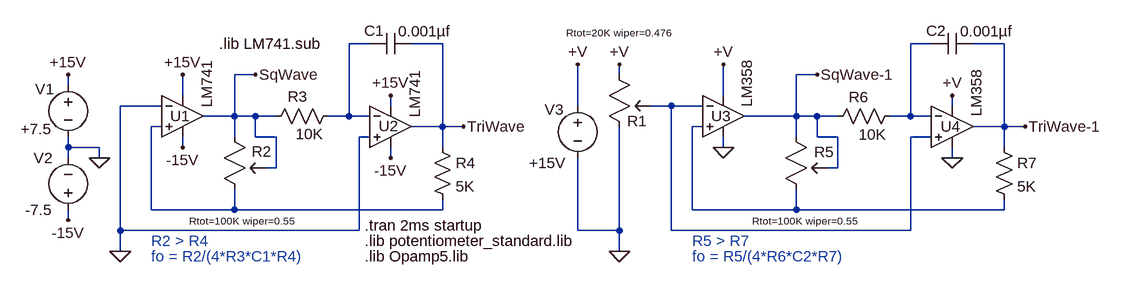
[diagram p0: schematic PWMMotorController-Comp-LM741-LM358.asc]
PWMMotorController-Comp-LM741-LM358.asc, the LTspice schematic file:
Version 4
SHEET 1 1620 680
WIRE -240 -96 -272 -96
WIRE -128 -96 -176 -96
WIRE 624 -96 592 -96
WIRE 736 -96 688 -96
WIRE -416 -48 -448 -48
WIRE 144 -48 144 -64
WIRE 448 -48 416 -48
WIRE -704 -32 -704 -48
WIRE -528 -16 -528 -48
WIRE 304 -16 304 -64
WIRE -560 0 -624 0
WIRE -208 0 -208 -16
WIRE 80 0 80 -64
WIRE 224 0 192 0
WIRE 272 0 224 0
WIRE 656 0 656 -16
WIRE -448 16 -448 -48
WIRE -448 16 -496 16
WIRE -416 16 -448 16
WIRE -384 16 -416 16
WIRE -272 16 -272 -96
WIRE -272 16 -304 16
WIRE -240 16 -272 16
WIRE 416 16 416 -48
WIRE 416 16 336 16
WIRE 448 16 416 16
WIRE 480 16 448 16
WIRE 592 16 592 -96
WIRE 592 16 560 16
WIRE 624 16 592 16
WIRE -560 32 -576 32
WIRE -128 32 -128 -96
WIRE -128 32 -176 32
WIRE -96 32 -128 32
WIRE 272 32 256 32
WIRE 736 32 736 -96
WIRE 736 32 688 32
WIRE 768 32 736 32
WIRE -448 48 -448 16
WIRE -416 48 -416 16
WIRE -384 48 -416 48
WIRE -240 48 -256 48
WIRE 416 48 416 16
WIRE 448 48 448 16
WIRE 480 48 448 48
WIRE 624 48 592 48
WIRE -704 64 -704 48
WIRE -656 64 -704 64
WIRE -528 64 -528 48
WIRE -128 64 -128 32
WIRE 304 64 304 48
WIRE 736 64 736 32
WIRE -704 80 -704 64
WIRE -656 80 -656 64
WIRE -208 80 -208 64
WIRE 656 80 656 64
WIRE -384 96 -384 48
WIRE -384 96 -400 96
WIRE 480 96 480 48
WIRE 480 96 464 96
WIRE -576 160 -576 32
WIRE -448 160 -448 128
WIRE -448 160 -576 160
WIRE -128 160 -128 144
WIRE -128 160 -448 160
WIRE 256 160 256 32
WIRE 416 160 416 128
WIRE 416 160 256 160
WIRE 736 160 736 144
WIRE 736 160 416 160
WIRE -704 176 -704 160
WIRE -624 192 -624 0
WIRE -256 192 -256 48
WIRE -256 192 -624 192
WIRE 80 192 80 80
WIRE 144 192 144 32
WIRE 144 192 80 192
WIRE 224 192 224 0
WIRE 592 192 592 48
WIRE 592 192 224 192
WIRE -624 224 -624 192
WIRE 144 224 144 192
FLAG -624 224 0
FLAG -416 -48 SqWave
FLAG -96 32 TriWave
FLAG -656 80 0
FLAG -704 -48 +15V
FLAG -704 176 -15V
FLAG -528 -48 +15V
FLAG -208 -16 +15V
FLAG -528 64 -15V
FLAG -208 80 -15V
FLAG 144 224 0
FLAG 448 -48 SqWave-1
FLAG 768 32 TriWave-1
FLAG 80 -64 +V
FLAG 304 -64 +V
FLAG 656 -16 +V
FLAG 304 64 0
FLAG 656 80 0
FLAG 144 -64 +V
SYMBOL potentiometer -464 32 R0
WINDOW 0 42 38 Left 2
WINDOW 3 -54 145 Left 1
SYMATTR InstName R2
SYMATTR Value Rtot=100K wiper=0.55
SYMBOL res -288 0 R90
WINDOW 0 1 63 VBottom 2
WINDOW 3 43 66 VLeft 2
SYMATTR InstName R3
SYMATTR Value 10K
SYMBOL cap -176 -112 R90
WINDOW 0 12 57 VBottom 2
WINDOW 3 -3 20 VLeft 2
SYMATTR InstName C1
SYMATTR Value 0.001µf
SYMBOL OpAmps\\opamp2 -528 -48 R0
WINDOW 3 37 51 VLeft 2
WINDOW 0 -19 64 Left 2
SYMATTR Value LM741
SYMATTR InstName U1
SYMBOL OpAmps\\opamp2 -208 -32 R0
WINDOW 3 37 50 VLeft 2
WINDOW 0 -18 63 Left 2
SYMATTR Value LM741
SYMATTR InstName U2
SYMBOL res -144 48 R0
SYMATTR InstName R4
SYMATTR Value 5K
SYMBOL voltage -704 -48 R0
WINDOW 0 -51 22 Left 2
WINDOW 3 -73 84 Left 2
SYMATTR InstName V1
SYMATTR Value +7.5
SYMBOL voltage -704 176 R180
WINDOW 0 24 96 Left 2
WINDOW 3 24 16 Left 2
SYMATTR InstName V2
SYMATTR Value -7.5
SYMBOL potentiometer 400 32 R0
WINDOW 0 44 39 Left 2
WINDOW 3 -52 145 Left 1
SYMATTR InstName R5
SYMATTR Value Rtot=100K wiper=0.55
SYMBOL res 576 0 R90
WINDOW 0 2 64 VBottom 2
WINDOW 3 44 64 VLeft 2
SYMATTR InstName R6
SYMATTR Value 10K
SYMBOL cap 688 -112 R90
WINDOW 0 12 57 VBottom 2
WINDOW 3 -3 20 VLeft 2
SYMATTR InstName C2
SYMATTR Value 0.001µf
SYMBOL OpAmps\\opamp2 304 -48 R0
WINDOW 3 36 13 VCenter 2
WINDOW 0 -19 64 Left 2
SYMATTR Value LM358
SYMATTR InstName U3
SYMBOL OpAmps\\opamp2 656 -32 R0
WINDOW 3 37 12 VCenter 2
WINDOW 0 -18 64 Left 2
SYMATTR Value LM358
SYMATTR InstName U4
SYMBOL res 720 48 R0
SYMATTR InstName R7
SYMATTR Value 5K
SYMBOL voltage 80 -16 R0
WINDOW 0 -51 22 Left 2
WINDOW 3 -75 104 Left 2
SYMATTR InstName V3
SYMATTR Value +15V
SYMBOL potentiometer 128 -64 R0
WINDOW 0 28 87 Left 2
WINDOW 3 -66 -49 Left 1
SYMATTR InstName R1
SYMATTR Value Rtot=20K wiper=0.476
TEXT -248 208 Left 2 !.lib potentiometer_standard.lib
TEXT -248 184 Left 2 !.tran 2ms startup
TEXT -472 -96 Left 2 !.lib LM741.sub
TEXT -248 232 Left 2 !.lib Opamp5.lib
TEXT -576 232 Left 2 ;fo = R2/(4*R3*C1*R4)
TEXT 256 232 Left 2 ;fo = R5/(4*R6*C2*R7)
TEXT -576 208 Left 2 ;R2 > R4
TEXT 256 208 Left 2 ;R5 > R7

The netlist it stands for:
* PWMMotorController-Comp-LM741-LM358.asc
XR2 SqWave N004 SqWave potentiometer Rtot=100K wiper=0.55  ; pins A B C
R3 N001 SqWave 10K
C1 TriWave N001 0.001µf
XU1 N004 0 +15V -15V SqWave LM741  ; pins In+ In- V+ V- OUT
XU2 0 N001 +15V -15V TriWave LM741  ; pins In+ In- V+ V- OUT
R4 TriWave N004 5K
V1 +15V 0 +7.5
V2 -15V 0 -7.5
XR5 SqWave-1 N005 SqWave-1 potentiometer Rtot=100K wiper=0.55  ; pins A B C
R6 N002 SqWave-1 10K
C2 TriWave-1 N002 0.001µf
XU3 N005 N003 +V 0 SqWave-1 LM358  ; pins In+ In- V+ V- OUT
XU4 N003 N002 +V 0 TriWave-1 LM358  ; pins In+ In- V+ V- OUT
R7 TriWave-1 N005 5K
V3 +V 0 +15V
XR1 +V 0 N003 potentiometer Rtot=20K wiper=0.476  ; pins A B C
.lib potentiometer_standard.lib
.tran 2ms startup
.lib LM741.sub
.lib Opamp5.lib
* fo = R2/(4*R3*C1*R4)
* fo = R5/(4*R6*C2*R7)
* R2 > R4
* R5 > R7
.backanno
.end